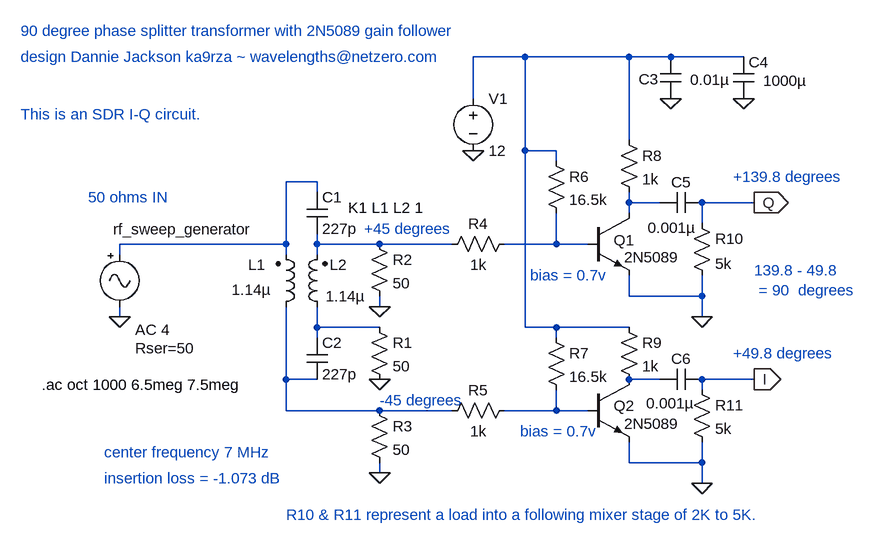
[diagram p0: schematic SDR_I-Q_2N5089.asc]
SDR_I-Q_2N5089.asc, the LTspice schematic file:
Version 4
SHEET 1 924 680
WIRE 80 -144 0 -144
WIRE 240 -144 80 -144
WIRE 304 -144 240 -144
WIRE 416 -144 304 -144
WIRE 0 -80 0 -144
WIRE 240 -16 240 -144
WIRE 80 0 80 -144
WIRE 128 0 80 0
WIRE 128 16 128 0
WIRE -240 48 -288 48
WIRE -240 64 -240 48
WIRE 240 80 240 64
WIRE 288 80 240 80
WIRE 432 80 352 80
WIRE 240 96 240 80
WIRE 352 112 352 80
WIRE -288 144 -288 48
WIRE -288 144 -544 144
WIRE -240 144 -240 128
WIRE -144 144 -240 144
WIRE -32 144 -144 144
WIRE 128 144 128 96
WIRE 128 144 48 144
WIRE 176 144 128 144
WIRE -544 160 -544 144
WIRE -288 160 -288 144
WIRE -240 160 -240 144
WIRE 240 224 240 192
WIRE 352 224 352 192
WIRE 352 224 240 224
WIRE -144 240 -144 224
WIRE -544 256 -544 240
WIRE 352 256 352 224
WIRE -240 272 -240 240
WIRE -144 272 -240 272
WIRE 80 272 80 0
WIRE 128 272 80 272
WIRE 240 272 128 272
WIRE -240 288 -240 272
WIRE 128 288 128 272
WIRE -288 352 -288 240
WIRE -240 352 -288 352
WIRE 288 352 240 352
WIRE 432 352 352 352
WIRE 352 368 352 352
WIRE -288 400 -288 352
WIRE -144 400 -288 400
WIRE -32 400 -144 400
WIRE 128 400 128 368
WIRE 128 400 48 400
WIRE 176 400 128 400
WIRE 240 480 240 448
WIRE 352 480 352 448
WIRE 352 480 240 480
WIRE -144 496 -144 480
WIRE 352 512 352 480
FLAG -544 256 0
FLAG -144 352 0
FLAG 0 0 0
FLAG 432 80 Q
IOPIN 432 80 Out
FLAG 432 352 I
IOPIN 432 352 Out
FLAG 416 -80 0
FLAG 352 256 0
FLAG 352 512 0
FLAG -144 240 0
FLAG -144 496 0
FLAG 304 -80 0
SYMBOL ind2 -304 256 M180
WINDOW 0 -15 80 Right 0
WINDOW 3 -7 42 Right 0
SYMATTR InstName L1
SYMATTR Value 1.14µ
SYMATTR Type ind
SYMBOL ind2 -224 256 R180
WINDOW 0 -3 80 Right 0
WINDOW 3 3 32 Right 0
SYMATTR InstName L2
SYMATTR Value 1.14µ
SYMATTR Type ind
SYMBOL Misc\\signal -544 144 R0
WINDOW 3 24 104 Invisible 0
WINDOW 123 24 132 Left 0
WINDOW 39 24 160 Left 0
WINDOW 0 -10 -23 Left 0
SYMATTR Value SINE(0 1 7MHz)
SYMATTR Value2 AC 4
SYMATTR SpiceLine Rser=50
SYMATTR InstName rf_sweep_generator
SYMBOL cap -256 64 R0
SYMATTR InstName C1
SYMATTR Value 227p
SYMBOL cap -256 288 R0
SYMATTR InstName C2
SYMATTR Value 227p
SYMBOL res -160 256 R0
SYMATTR InstName R1
SYMATTR Value 50
SYMBOL res -160 128 R0
SYMATTR InstName R2
SYMATTR Value 50
SYMBOL res -160 384 R0
SYMATTR InstName R3
SYMATTR Value 50
SYMBOL npn 176 96 R0
WINDOW 0 40 42 Left 0
SYMATTR InstName Q1
SYMATTR Value 2N5089
SYMBOL voltage 0 -96 R0
WINDOW 123 0 0 Left 0
WINDOW 39 0 0 Left 0
SYMATTR InstName V1
SYMATTR Value 12
SYMBOL npn 176 352 R0
WINDOW 0 40 41 Left 0
SYMATTR InstName Q2
SYMATTR Value 2N5089
SYMBOL res 224 -32 R0
SYMATTR InstName R8
SYMATTR Value 1k
SYMBOL res 224 256 R0
SYMATTR InstName R9
SYMATTR Value 1k
SYMBOL res 336 96 R0
WINDOW 3 36 78 Left 0
SYMATTR Value 5k
SYMATTR InstName R10
SYMBOL res 336 352 R0
SYMATTR InstName R11
SYMATTR Value 5k
SYMBOL res 64 128 R90
WINDOW 0 0 56 VBottom 0
WINDOW 3 32 56 VTop 0
SYMATTR InstName R4
SYMATTR Value 1k
SYMBOL res 64 384 R90
WINDOW 0 0 56 VBottom 0
WINDOW 3 32 56 VTop 0
SYMATTR InstName R5
SYMATTR Value 1k
SYMBOL res 112 0 R0
SYMATTR InstName R6
SYMATTR Value 16.5k
SYMBOL res 112 272 R0
SYMATTR InstName R7
SYMATTR Value 16.5k
SYMBOL cap 400 -144 R0
WINDOW 3 46 37 Left 0
SYMATTR Value 1000µ
SYMATTR InstName C4
SYMBOL cap 288 -144 R0
WINDOW 0 -33 34 Left 0
WINDOW 3 46 35 Left 0
SYMATTR InstName C3
SYMATTR Value 0.01µ
SYMBOL cap 352 64 R90
WINDOW 0 0 32 VBottom 0
WINDOW 3 39 46 VTop 0
SYMATTR InstName C5
SYMATTR Value 0.001µ
SYMBOL cap 352 336 R90
WINDOW 0 0 32 VBottom 0
WINDOW 3 37 49 VTop 0
SYMATTR InstName C6
SYMATTR Value 0.001µ
TEXT -192 88 Left 0 !K1 L1 L2 1
TEXT -696 -184 Left 0 ;90 degree phase splitter transformer with 2N5089 gain follower
TEXT -696 -144 Left 0 ;design Dannie Jackson ka9rza ~ wavelengths@netzero.com
TEXT -568 464 Left 0 ;center frequency 7 MHz
TEXT -568 504 Left 0 ;insertion loss = -1.073 dB
TEXT -592 72 Left 0 ;50 ohms IN
TEXT -288 560 Left 0 ;R10 & R11 represent a load into a following mixer stage of 2K to 5K.
TEXT -696 -56 Left 0 ;This is an SDR I-Q circuit.
TEXT -664 360 Left 0 !.ac oct 1000 6.5meg 7.5meg
TEXT 88 192 Left 0 ;bias = 0.7v
TEXT 72 432 Left 0 ;bias = 0.7v
TEXT 400 40 Left 0 ;+139.8 degrees
TEXT 400 312 Left 0 ;+49.8 degrees
TEXT -144 384 Left 0 ;-45 degrees
TEXT -168 120 Left 0 ;+45 degrees
TEXT 432 184 Left 0 ;139.8 - 49.8\n = 90  degrees

The netlist it stands for:
* SDR_I-Q_2N5089.asc
L1 N007 N002 1.14µ
L2 N006 N004 1.14µ
V§rf_sweep_generator N002 0 SINE(0 1 7MHz) AC 4 Rser=50
C1 N002 N004 227p
C2 N006 N007 227p
R1 N006 0 50
R2 N004 0 50
R3 N007 0 50
Q1 N003 N005 0 0 2N5089
V1 N001 0 12
Q2 N008 N009 0 0 2N5089
R8 N001 N003 1k
R9 N001 N008 1k
R10 Q 0 5k
R11 I 0 5k
R4 N005 N004 1k
R5 N009 N007 1k
R6 N001 N005 16.5k
R7 N001 N009 16.5k
C4 N001 0 1000µ
C3 N001 0 0.01µ
C5 Q N003 0.001µ
C6 I N008 0.001µ
.model NPN NPN
.model PNP PNP
.lib standard.bjt
K1 L1 L2 1
* 90 degree phase splitter transformer with 2N5089 gain follower
* design Dannie Jackson ka9rza ~ wavelengths@netzero.com
* center frequency 7 MHz
* insertion loss = -1.073 dB
* 50 ohms IN
* R10 & R11 represent a load into a following mixer stage of 2K to 5K.
* This is an SDR I-Q circuit.
.ac oct 1000 6.5meg 7.5meg
* bias = 0.7v
* bias = 0.7v
* +139.8 degrees
* +49.8 degrees
* -45 degrees
* +45 degrees
* 139.8 - 49.8
*  = 90  degrees
.backanno
.end